# EAGLE design Flasche_v1 (EAGLE 6.4)
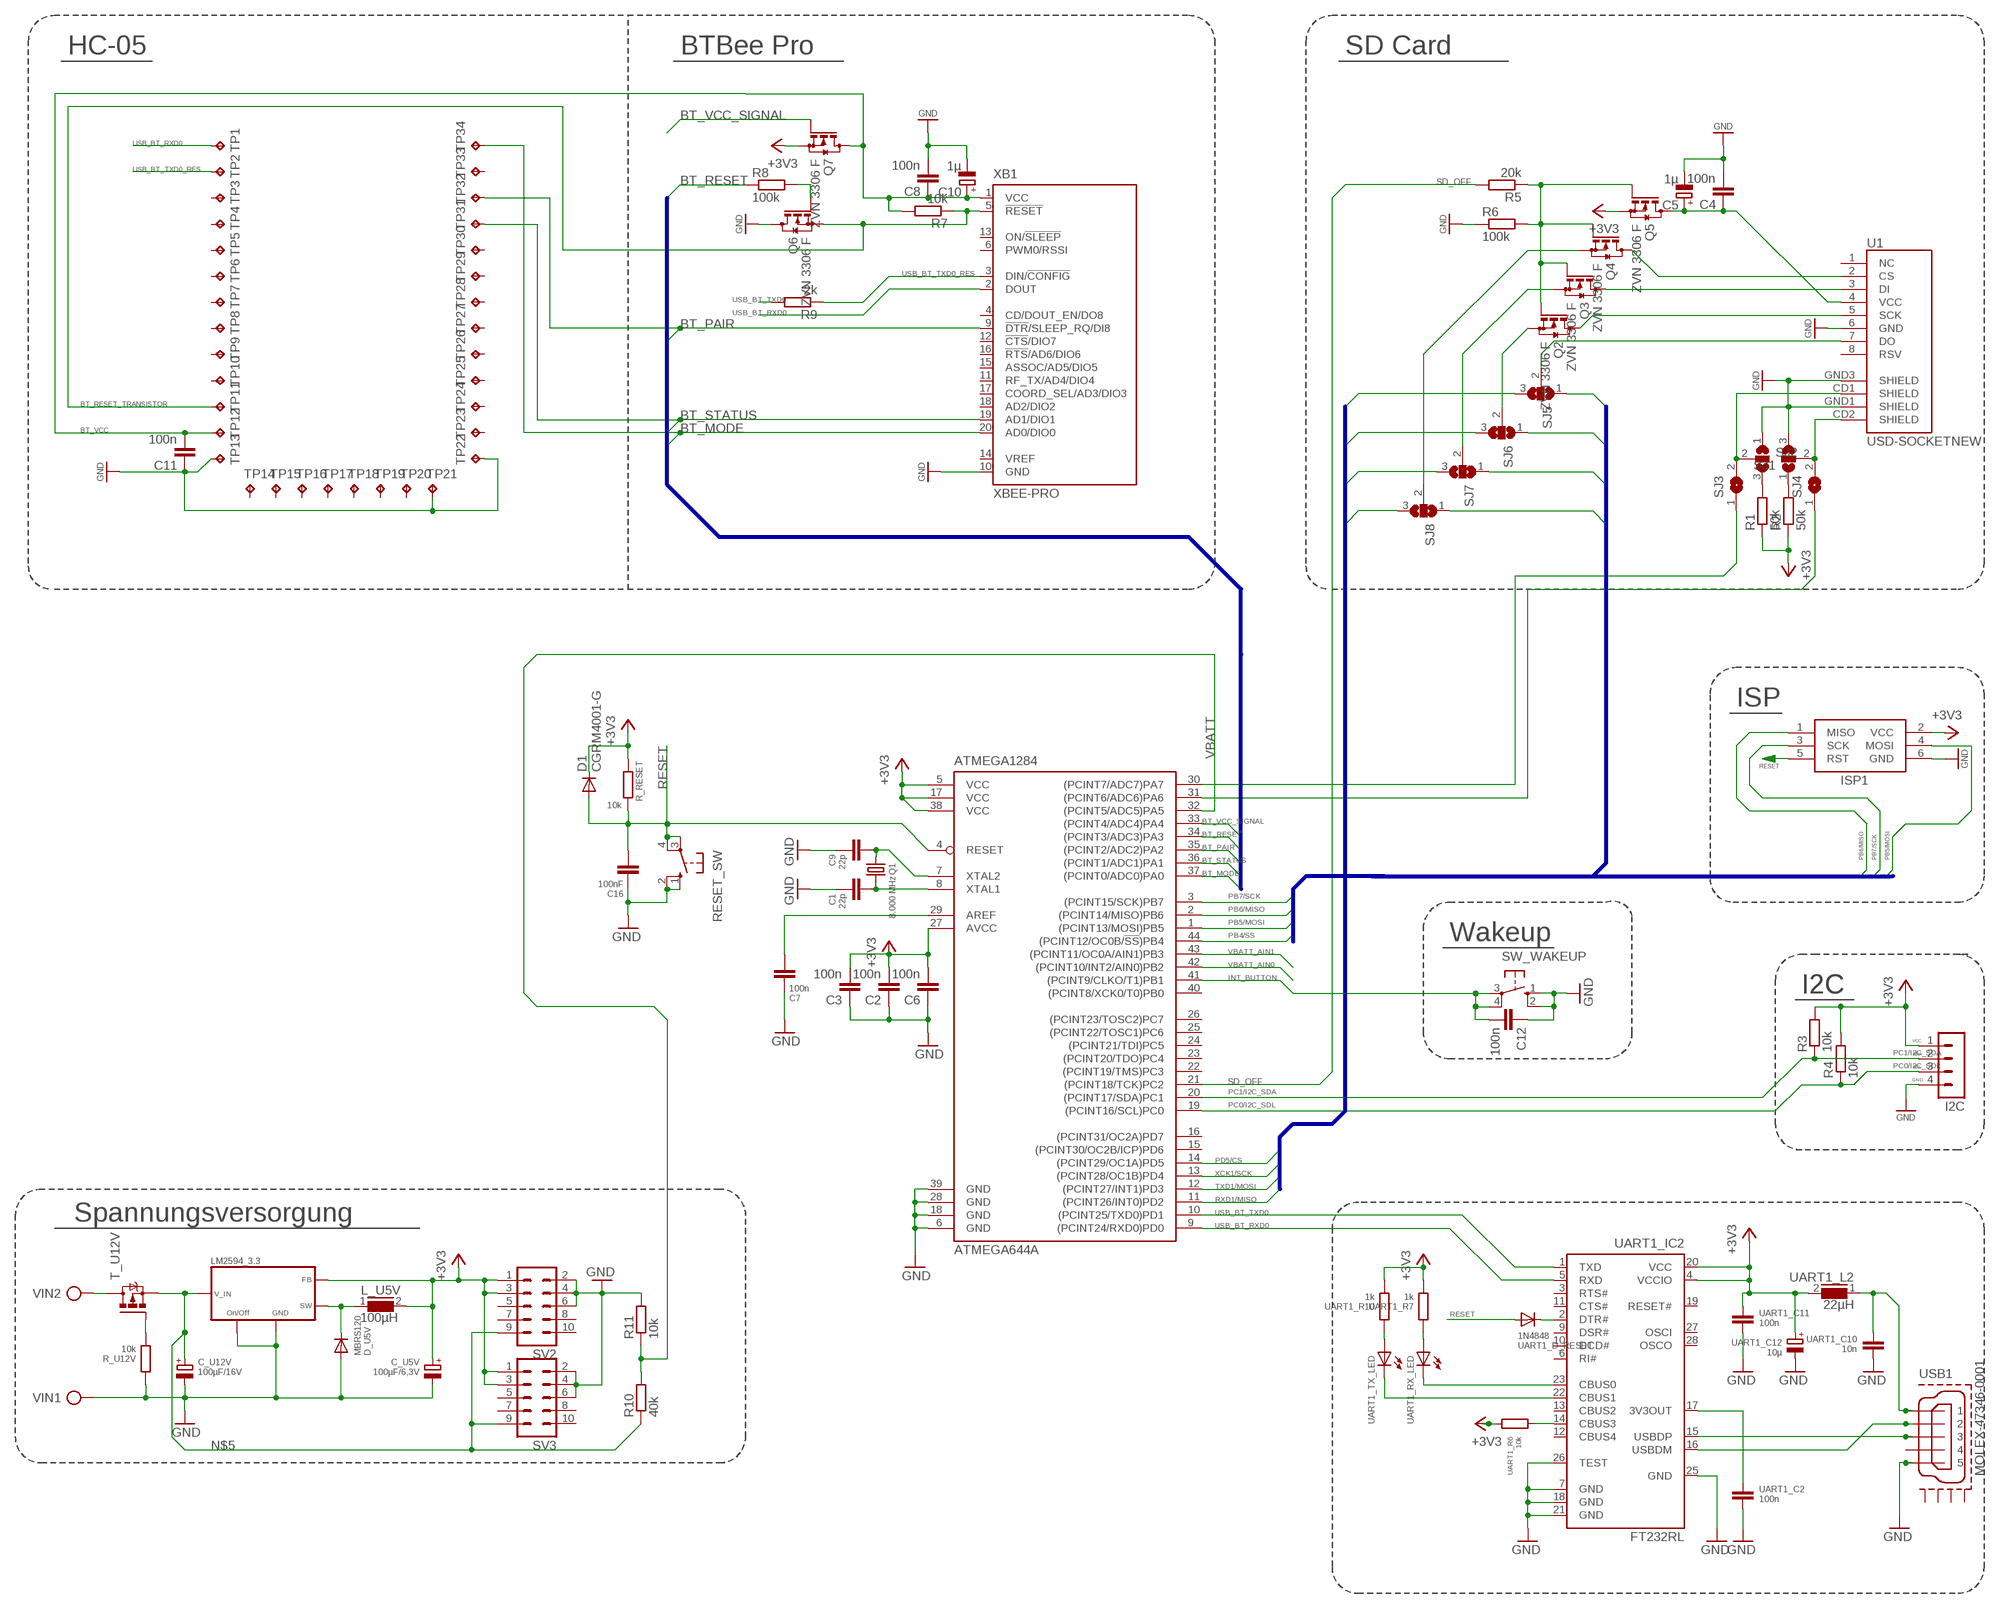
[diagram p0: schematic, sheet 1]

## Parts
ATMEGA1284  ATMEGA644A  [TQFP44]
C1  22p  C-0805  [C0805]
C2  100n  C-0805  [C0805]
C3  100n  C-0805  [C0805]
C4  100n  C-0805  [C0805]
C5  1µ  CPOL-EUSMCD  [SMC_D]
C6  100n  C-0805  [C0805]
C7  100n  C-0805  [C0805]
C8  100n  C-0805  [C0805]
C9  22p  C-0805  [C0805]
C10  1µ  CPOL-EUSMCD  [SMC_D]
C11  100n  C-0805  [C0805]
C12  100n  C-0805  [C0805]
C16  100nF  C-0805  [C0805]
C_U5V  100µF/6,3V  CPOL-EUSMCD  [SMC_D]
C_U12V  100µF/16V  CPOL-EUSMCD  [SMC_D]
D1  CGRM4001-G  [SOD-123_MINI-SMA]
D_U5V  MBRS120  D_SMB  [SMB]
I2C  MA04-1  [MA04-1]
ISP1  AVRISP-6  [AVRISP]
L_U5V  100µH  L_PISM  [PISM]
LM2594_3.3  LM2594  [SO08]
Q1  8.000 MHz  CRYSTALHC18U-V  [HC18U-V]
Q2  ZVN 3306 F  BSS123  [SOT23]
Q3  ZVN 3306 F  BSS123  [SOT23]
Q4  ZVN 3306 F  BSS123  [SOT23]
Q5  ZVN 3306 F  BSS123  [SOT23]
Q6  ZVN 3306 F  BSS123  [SOT23]
Q7  ZVN 3306 F  BSS123  [SOT23]
R1  50k  R-EU_M1206  [M1206]
R2  50k  R-EU_M1206  [M1206]
R3  10k  R-EU_M1206  [M1206]
R4  10k  R-EU_M1206  [M1206]
R5  20k  R-EU_M1206  [M1206]
R6  100k  R-EU_M1206  [M1206]
R7  10k  R-EU_M1206  [M1206]
R8  100k  R-EU_M1206  [M1206]
R9  2k  R-EU_M1206  [M1206]
R10  40k  R-EU_M1206  [M1206]
R11  10k  R-EU_M1206  [M1206]
R_RESET  10k  R-R0805  [R0805]
R_U12V  10k  R-R0805  [R0805]
RESET_SW  10-XX  [B3F-10XX]
SJ1  SJ2W  [SJ_2]
SJ2  SJ2W  [SJ_2]
SJ3  SJ  [SJ]
SJ4  SJ  [SJ]
SJ5  SJ2W  [SJ_2]
SJ6  SJ2W  [SJ_2]
SJ7  SJ2W  [SJ_2]
SJ8  SJ2W  [SJ_2]
SV2  ML10L  [ML10L]
SV3  ML10L  [ML10L]
SW_WAKEUP  10-XX  [B3F-10XX]
T_U12V  MOS_P_SOT23_GDS  [SOT23]
TP1  TPTP06SQ  [TP06SQ]
TP2  TPTP06SQ  [TP06SQ]
TP3  TPTP06SQ  [TP06SQ]
TP4  TPTP06SQ  [TP06SQ]
TP5  TPTP06SQ  [TP06SQ]
TP6  TPTP06SQ  [TP06SQ]
TP7  TPTP06SQ  [TP06SQ]
TP8  TPTP06SQ  [TP06SQ]
TP9  TPTP06SQ  [TP06SQ]
TP10  TPTP06SQ  [TP06SQ]
TP11  TPTP06SQ  [TP06SQ]
TP12  TPTP06SQ  [TP06SQ]
TP13  TPTP06SQ  [TP06SQ]
TP14  TPTP06SQ  [TP06SQ]
TP15  TPTP06SQ  [TP06SQ]
TP16  TPTP06SQ  [TP06SQ]
TP17  TPTP06SQ  [TP06SQ]
TP18  TPTP06SQ  [TP06SQ]
TP19  TPTP06SQ  [TP06SQ]
TP20  TPTP06SQ  [TP06SQ]
TP21  TPTP06SQ  [TP06SQ]
TP22  TPTP06SQ  [TP06SQ]
TP23  TPTP06SQ  [TP06SQ]
TP24  TPTP06SQ  [TP06SQ]
TP25  TPTP06SQ  [TP06SQ]
TP26  TPTP06SQ  [TP06SQ]
TP27  TPTP06SQ  [TP06SQ]
TP28  TPTP06SQ  [TP06SQ]
TP29  TPTP06SQ  [TP06SQ]
TP30  TPTP06SQ  [TP06SQ]
TP31  TPTP06SQ  [TP06SQ]
TP32  TPTP06SQ  [TP06SQ]
TP33  TPTP06SQ  [TP06SQ]
TP34  TPTP06SQ  [TP06SQ]
U1  USD-SOCKETNEW  [MICRO-SD-SOCKET-PP]
UART1_C2  100n  C-EUC0805  [C0805]
UART1_C10  10n  C-EUC0805  [C0805]
UART1_C11  100n  C-EUC0805  [C0805]
UART1_C12  10µ  CPOL-EUSMCD  [SMC_D]
UART1_D_RESET  1N4848  D_MINIMELF  [MINIMELF]
UART1_IC2  FT232RL  [SSOP28]
UART1_L2  22µH  L_PIS2408  [PIS2408]
UART1_R6  10k  R-EU_R0805  [R0805]
UART1_R7  1k  R-R0805  [R0805]
UART1_R10  1k  R-R0805  [R0805]
UART1_RX_LED  LEDCHIPLED_0805  [CHIPLED_0805]
UART1_TX_LED  LEDCHIPLED_0805  [CHIPLED_0805]
USB1  MOLEX-47346-0001  [MOLEX-47364-0001]
VIN  AK350/2  [AK350/2]
XB1  XBEE-PRO  [XBEE-PRO]

## Nets
+3V3: ATMEGA1284.5(VCC) ATMEGA1284.17(VCC) ATMEGA1284.27(AVCC) ATMEGA1284.38(VCC) C2.2 C3.2 C6.2 C_U5V.+ D1.C I2C.1 ISP1.2(VCC) L_U5V.2 LM2594_3.3.4(FB) Q5.2(S) Q7.2(S) R1.1 R2.1 R3.2 R4.2 R_RESET.2 SV2.1 SV2.3 SV3.1 SV3.3 UART1_C11.1 UART1_C12.+ UART1_IC2.4(VCCIO) UART1_IC2.20(VCC) UART1_L2.2 UART1_R6.2 UART1_R7.1 UART1_R10.1
AREF: ATMEGA1284.29(AREF) C7.2
BT_MODE: ATMEGA1284.37((PCINT0/ADC0)PA0) TP34.TP XB1.20(AD0/DIO0)
BT_PAIR: ATMEGA1284.35((PCINT2/ADC2)PA2) TP32.TP XB1.9(!DTR!/SLEEP_RQ/DI8)
BT_RESET: ATMEGA1284.34((PCINT3/ADC3)PA3) R8.1
BT_RESET_TRANSISTOR: Q6.2(S) R7.1 TP11.TP XB1.5(!RESET)
BT_STATUS: ATMEGA1284.36((PCINT1/ADC1)PA1) TP31.TP XB1.19(AD1/DIO1)
BT_VCC: C8.1 C10.+ C11.2 Q7.3(D) R7.2 TP12.TP XB1.1(VCC)
BT_VCC_SIGNAL: ATMEGA1284.33((PCINT4/ADC4)PA4) Q7.1(G)
DTR#: UART1_D_RESET.C UART1_IC2.2(DTR#)
GND: ATMEGA1284.6(GND) ATMEGA1284.18(GND) ATMEGA1284.28(GND) ATMEGA1284.39(GND) C1.1 C2.1 C3.1 C4.2 C5.- C6.1 C7.1 C8.2 C9.1 C10.- C11.1 C12.1 C16.1 C_U5V.- C_U12V.- D_U5V.A I2C.4 ISP1.6(GND) LM2594_3.3.5(ON/OFF) LM2594_3.3.6(GND) Q6.3(D) R6.1 R11.2 R_U12V.2 RESET_SW.1(S) RESET_SW.2(S1) SJ1.3 SJ2.1 SV2.2 SV2.4 SV2.6 SV3.2 SV3.4 SV3.6 SW_WAKEUP.1(S) SW_WAKEUP.2(S1) TP13.TP TP21.TP TP22.TP U1.6(GND) U1.GND1(SHIELD) U1.GND3(SHIELD) UART1_C2.2 UART1_C10.2 UART1_C11.2 UART1_C12.- UART1_IC2.7(GND) UART1_IC2.18(GND) UART1_IC2.21(GND) UART1_IC2.25(GND) UART1_IC2.26(TEST) USB1.5 VIN.P$1 XB1.10(GND)
INT_BUTTON: ATMEGA1284.41((PCINT9/CLKO/T1)PB1) C12.2 SW_WAKEUP.3(P) SW_WAKEUP.4(P1)
N$1: UART1_R10.2 UART1_TX_LED.A
N$2: UART1_C2.1 UART1_IC2.17(3V3OUT)
N$3: T_U12V.2(D) VIN.P$2
N$4: UART1_IC2.16(USBDM) USB1.2
N$5: C_U12V.+ LM2594_3.3.7(IN) R10.1 SV2.9 SV3.9 T_U12V.3(S)
N$9: UART1_R7.2 UART1_RX_LED.A
N$10: UART1_IC2.15(USBDP) USB1.3
N$11: UART1_IC2.14(CBUS3) UART1_R6.1
N$12: UART1_C10.1 UART1_L2.1 USB1.1
N$13: UART1_IC2.23(CBUS0) UART1_RX_LED.C
N$14: UART1_IC2.22(CBUS1) UART1_TX_LED.C
N$16: SJ2.2 SJ3.2 U1.CD1(SHIELD)
N$17: SJ1.2 SJ4.2 U1.CD2(SHIELD)
N$18: R_U12V.1 T_U12V.1(G)
N$20: ATMEGA1284.31((PCINT6/ADC6)PA6) SJ4.1
N$21: R1.2 SJ2.3
N$22: R2.2 SJ1.1
N$24: SJ5.2 U1.7(DO)
N$25: ATMEGA1284.30((PCINT7/ADC7)PA7) SJ3.1
N$26: Q2.2(S) SJ6.2
N$27: Q3.2(S) SJ7.2
N$28: Q4.3(D) U1.2(CS)
N$29: Q3.3(D) U1.3(DI)
N$30: Q2.3(D) U1.5(SCK)
N$31: C4.1 C5.+ Q5.3(D) U1.4(VCC)
N$33: Q2.1(G) Q3.1(G) Q4.1(G) Q5.1(G) R5.1 R6.2
N$34: Q6.1(G) R8.2
PB4/SS: ATMEGA1284.44((PCINT12/OC0B/!SS!)PB4) SJ8.1
PB5/MOSI: ATMEGA1284.1((PCINT13/MOSI)PB5) ISP1.4(MOSI) SJ7.1
PB6/MISO: ATMEGA1284.2((PCINT14/MISO)PB6) ISP1.1(MISO) SJ5.1
PB7/SCK: ATMEGA1284.3((PCINT15/SCK)PB7) ISP1.3(SCK) SJ6.1
PC0/I2C_SDL: ATMEGA1284.19((PCINT16/SCL)PC0) I2C.3 R4.1
PC1/I2C_SDA: ATMEGA1284.20((PCINT17/SDA)PC1) I2C.2 R3.1
PD5/CS: ATMEGA1284.14((PCINT29/OC1A)PD5) SJ8.3
RESET: ATMEGA1284.4(RESET) C16.2 D1.A ISP1.5(RST) R_RESET.1 RESET_SW.3(P) RESET_SW.4(P1) UART1_D_RESET.A
RXD1/MISO: ATMEGA1284.11((PCINT26/INT0)PD2) SJ5.3
SD_CS: Q4.2(S) SJ8.2
SD_OFF: ATMEGA1284.21((PCINT18/TCK)PC2) R5.2
SWITCH_OUT: D_U5V.C L_U5V.1 LM2594_3.3.8(SW)
TXD1/MOSI: ATMEGA1284.12((PCINT27/INT1)PD3) SJ7.3
USB_BT_RXD0: ATMEGA1284.9((PCINT24/RXD0)PD0) TP1.TP UART1_IC2.5(RXD) XB1.2(DOUT)
USB_BT_TXD0: ATMEGA1284.10((PCINT25/TXD0)PD1) R9.2 UART1_IC2.1(TXD)
USB_BT_TXD0_RES: R9.1 TP2.TP XB1.3(DIN/!CONFIG)
VBATT: ATMEGA1284.32((PCINT5/ADC5)PA5) R10.2 R11.1
VBATT_AIN0: ATMEGA1284.42((PCINT10/INT2/AIN0)PB2)
VBATT_AIN1: ATMEGA1284.43((PCINT11/OC0A/AIN1)PB3)
XCK1/SCK: ATMEGA1284.13((PCINT28/OC1B)PD4) SJ6.3
XTAL1: ATMEGA1284.8(XTAL1) C1.2 Q1.1
XTAL2: ATMEGA1284.7(XTAL2) C9.2 Q1.2
Unconnected: ATMEGA1284.15((PCINT30/OC2B/ICP)PD6) ATMEGA1284.16((PCINT31/OC2A)PD7) ATMEGA1284.22((PCINT19/TMS)PC3) ATMEGA1284.23((PCINT20/TDO)PC4) ATMEGA1284.24((PCINT21/TDI)PC5) ATMEGA1284.25((PCINT22/TOSC1)PC6) ATMEGA1284.26((PCINT23/TOSC2)PC7) ATMEGA1284.40((PCINT8/XCK0/T0)PB0) SV2.5 SV2.7 SV2.8 SV2.10 SV3.5 SV3.7 SV3.8 SV3.10 TP3.TP TP4.TP TP5.TP TP6.TP TP7.TP TP8.TP TP9.TP TP10.TP TP14.TP TP15.TP TP16.TP TP17.TP TP18.TP TP19.TP TP20.TP TP23.TP TP24.TP TP25.TP TP26.TP TP27.TP TP28.TP TP29.TP TP30.TP TP33.TP U1.1(NC) U1.8(RSV) UART1_IC2.3(RTS#) UART1_IC2.6(RI#) UART1_IC2.9(DSR#) UART1_IC2.10(DCD#) UART1_IC2.11(CTS#) UART1_IC2.12(CBUS4) UART1_IC2.13(CBUS2) UART1_IC2.19(RESET#) UART1_IC2.27(OSCI) UART1_IC2.28(OSCO) USB1.4 USB1.GND1 USB1.GND2 USB1.GND3 USB1.GND4 XB1.4(CD/DOUT_EN/DO8) XB1.6(PWM0/RSSI) XB1.11(RF_TX/AD4/DIO4) XB1.12(!CTS!/DIO7) XB1.13(ON/!SLEEP) XB1.14(VREF) XB1.15(ASSOC/AD5/DIO5) XB1.16(!RTS!/AD6/DIO6) XB1.17(COORD_SEL/AD3/DIO3) XB1.18(AD2/DIO2)

## Buses
BLUETOOTH:BT_VCC_SIGNAL,BT_RESET,BT_PAIR,BT_STATUS,BT_MODE
SPI_NATIV:PB7/SCK,PB6/MISO,PB5/MOSI,PB4/SS
SPI_ALTERNATIV:PD5/CS,XCK1/SCK,TXD1/MOSI,RXD1/MISO

## Notes on the sheet
- HC-05 | BTBee Pro | SD Card
- (TCK) | (TMS) | (TDO) | (TDI) | (RESET) | (SCK) | (PDI/MOSI) | (PDO/MISO)
- (TCK) | (TMS) | (TDO) | (TDI) | (RESET) | (SCK) | (PDI/MOSI) | (PDO/MISO)
- ISP
- Wakeup
- I2C | I2C
- VCC
- SDA
- SCL
- GND
- Spannungsversorgung

## Library data of the parts
ATMEGA1284 = atmel:ATMEGA644: 8-bit Microcontroller with 64K Bytes In-System Programmable Flash Source: http://www.atmel.com/dyn/resources/prod_documents/doc2593.pdf; MPN: ATMEGA644PV-10AU; OC_FARNELL: 1455123; OC_NEWARK: 58M3748
C1-C4 C6-C9 C11 C12 C16 = quantum-sensor:C: Capacitor
C5 C10 = rcl:CPOL-EU: POLARIZED CAPACITOR, European symbol
C_U5V C_U12V UART1_C12 = _E:CPOL-EU: POLARIZED CAPACITOR, European symbol
D1 = diode:CGRM400*-G: Molded plasitc,JEDEC SOD-123/Mini SMA Source: Comchip CGRM4001-G.pdf
D_U5V UART1_D_RESET = _D:D: DIODE Name Package Type Reverse Voltage Forward Current Reverse Recovery Time trr SB320, SB330, SB340, SB350, SB360, SB380, SB3100 Do201 Schottky 20V, 30V, 40V, 50V, 60V, 80V, 100V 3A SB520, SB530, SB540, SB550, SB560 Do201 Schottky 20V, 30V, 40V, 50V, 60V 5A 1N5817, 1N5818, 1N5819 Do201 Schottky 20V, 30V, 40V 1A 1N5820, 1N5821, 1N5822 Do201 Schottky 20V, 30V, 40V 3A 1N4001, 1N4002, 1N4003, 1N4004, 1N4005, 1N4006, 1N4007 Do41 Standard 50V, 100V, 200V, 400V, 600V, 800V, 1000V 1A (4001,...,4004) 50ns, (4005, ..,4007) 75ns 1N4148 Do35 / MiniMELF Standard 100V 150mA 4ns BYV26A, BYV26B, BYV26C, BYV26D, BYV26E SOD57 Ultra Fast 200V, 400V ,600V, 800V, 1000V 2A (BYV26A,...,BYV26C) 30ns, (BYV26D, BYV26E) 75ns BYV27-600 SOD57 Ultra Fast 600V 2A 35ns MBRS120 SMB Schottky 20V 1A MBRS340 SMC Schottky 40V 3A BAT85 DO-34 Schottky 30V 200mA
I2C = con-lstb:MA04-1: PIN HEADER; OC_FARNELL: unknown; OC_NEWARK: unknown
ISP1 = adafruit:AVRISP: AVR ISP HEADER Standard 6 pin header for AVR programming
L_U5V UART1_L2 = _Trafo_Spule:L: INDUCTOR
LM2594_3.3 = _Voltage_Regulators:LM2594: LM2594/LM2594HV SIMPLE SWITCHER® Power Converter 150 kHz 0.5A Step-Down Voltage Regulator
Q1 = crystal:CRYSTAL: CRYSTAL; OC_FARNELL: unknown; OC_NEWARK: unknown
Q2-Q7 = transistor-small-signal:BSS123: N-CHANNEL MOS FET
R1-R11 = rcl:R-EU_: RESISTOR, European symbol
R_RESET R_U12V UART1_R7 UART1_R10 = quantum-sensor:R: Resistor
RESET_SW SW_WAKEUP = switch-omron:10-XX: OMRON SWITCH; MPN: B3F-1000; OC_FARNELL: 176432; OC_NEWARK: 36M3542
SJ1 SJ2 SJ5-SJ8 = jumper:SJ2W: SMD solder JUMPER
SJ3 SJ4 = jumper:SJ: SMD solder JUMPER
SV2 SV3 = con-ml:ML10L: HARTING; OC_FARNELL: unknown; OC_NEWARK: unknown
T_U12V = _transistor:MOS_P: P - CHANNEL ENHANCEMENT MODE (POWER ) MOS TRANSISTOR Name Package VDS ID PD RDS(on) VGS ttd(on) tr ttd(off) tf IRF9530 TO220_GDS -100V 12A 75W 0.3Ω ±20V 30ns 70ns 70ns 70ns FDN360P SOT23_GDS -30V -2.0A 0.5W 0.1Ω ±20V 6ns 13ns 11ns 6ns
TP1-TP34 = testpad:TP: Test pad
U1 = SparkFun-Connectors:USD-SOCKET: microSD Socket Push-push type uSD socket. Schematic element and footprint production proven. Spark Fun Electronics SKU : PRT-00127. tDoc lines correctly indicate media card edge positions when inserting (unlocked, locked, depressed).
UART1_C2 UART1_C10 UART1_C11 = _C:C-EU: CAPACITOR, European symbol
UART1_IC2 = FTDI:FT232R: Source: http://www.ftdichip.com/Documents/DataSheets/DS_FT232R_v104.pdf
UART1_R6 = _R:R-EU_: RESISTOR, European symbol
UART1_RX_LED UART1_TX_LED = led:LED: LED OSRAM: - CHIPLED LG R971, LG N971, LY N971, LG Q971, LY Q971, LO R971, LY R971 LH N974, LH R974 LS Q976, LO Q976, LY Q976 LO Q996 - Hyper CHIPLED LW Q18S LB Q993, LB Q99A, LB R99A - SideLED LS A670, LO A670, LY A670, LG A670, LP A670 LB A673, LV A673, LT A673, LW A673 LH A674 LY A675 LS A676, LA A676, LO A676, LY A676, LW A676 LS A679, LY A679, LG A679 - Hyper Micro SIDELED® LS Y876, LA Y876, LO Y876, LY Y876 LT Y87S - SmartLED LW L88C, LW L88S LB L89C, LB L89S, LG L890 LS L89K, LO L89K, LY L89K LS L896, LA L896, LO L896, LY L896 - TOPLED LS T670, LO T670, LY T670, LG T670, LP T670 LSG T670, LSP T670, LSY T670, LOP T670, LYG T670 LG T671, LOG T671, LSG T671 LB T673, LV T673, LT T673, LW T673 LH T674 LS T676, LA T676, LO T676, LY T676, LB T676, LH T676, LSB T676, LW T676 LB T67C, LV T67C, LT T67C, LS T67K, LO T67K, LY T67K, LW E67C LS E67B, LA E67B, LO E67B, LY E67B, LB E67C, LV E67C, LT E67C LW T67C LS T679, LY T679, LG T679 LS T770, LO T770, LY T770, LG T770, LP T770 LB T773, LV T773, LT T773, LW T773 LH T774 LS E675, LA E675, LY E675, LS T675 LS T776, LA T776, LO T776, LY T776, LB T776 LHGB T686 LT T68C, LB T68C - Hyper Mini TOPLED® LB M676 - Mini TOPLED Santana® LG M470 LS M47K, LO M47K, LY M47K Source: http://www.osram.convergy.de LUXEON: - LUMILED® LXK2-PW12-R00, LXK2-PW12-S00, LXK2-PW14-U00, LXK2-PW14-V00 LXK2-PM12-R00, LXK2-PM12-S00, LXK2-PM14-U00 LXK2-PE12-Q00, LXK2-PE12-R00, LXK2-PE12-S00, LXK2-PE14-T00, LXK2-PE14-U00 LXK2-PB12-K00, LXK2-PB12-L00, LXK2-PB12-M00, LXK2-PB14-N00, LXK2-PB14-P00, LXK2-PB14-Q00 LXK2-PR12-L00, LXK2-PR12-M00, LXK2-PR14-Q00, LXK2-PR14-R00 LXK2-PD12-Q00, LXK2-PD12-R00, LXK2-PD12-S00 LXK2-PH12-R00, LXK2-PH12-S00 LXK2-PL12-P00, LXK2-PL12-Q00, LXK2-PL12-R00 Source: www.luxeon.com KINGBRIGHT: KA-3528ASYC Source: www.kingbright.com
USB1 = usb_con-update:MOLEX-47346-0001: MICRO USB B, BOTTOM MOUNT
VIN = con-ptr500:AK350/2: CONNECTOR Raster: 3,5mm
XB1 = maxstream:XBEE: XBee (TM) /XBee-PRO(TM) OEM RF Modules Source: MaxStream, Inc. xbee_productmanual.pdf; MPN: XBP24-AWI-001; OC_FARNELL: 1337916; OC_NEWARK: 42M2667

## Board
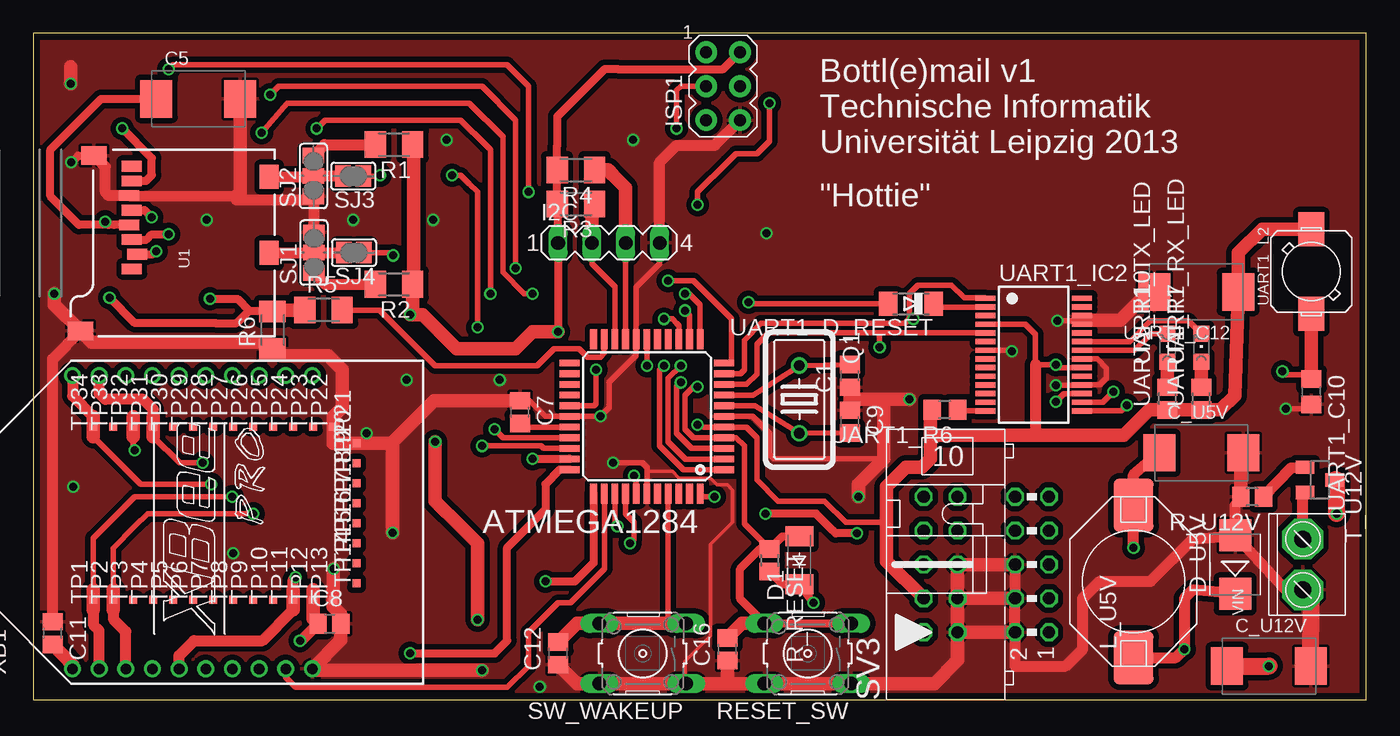
[diagram p1: board, top side]
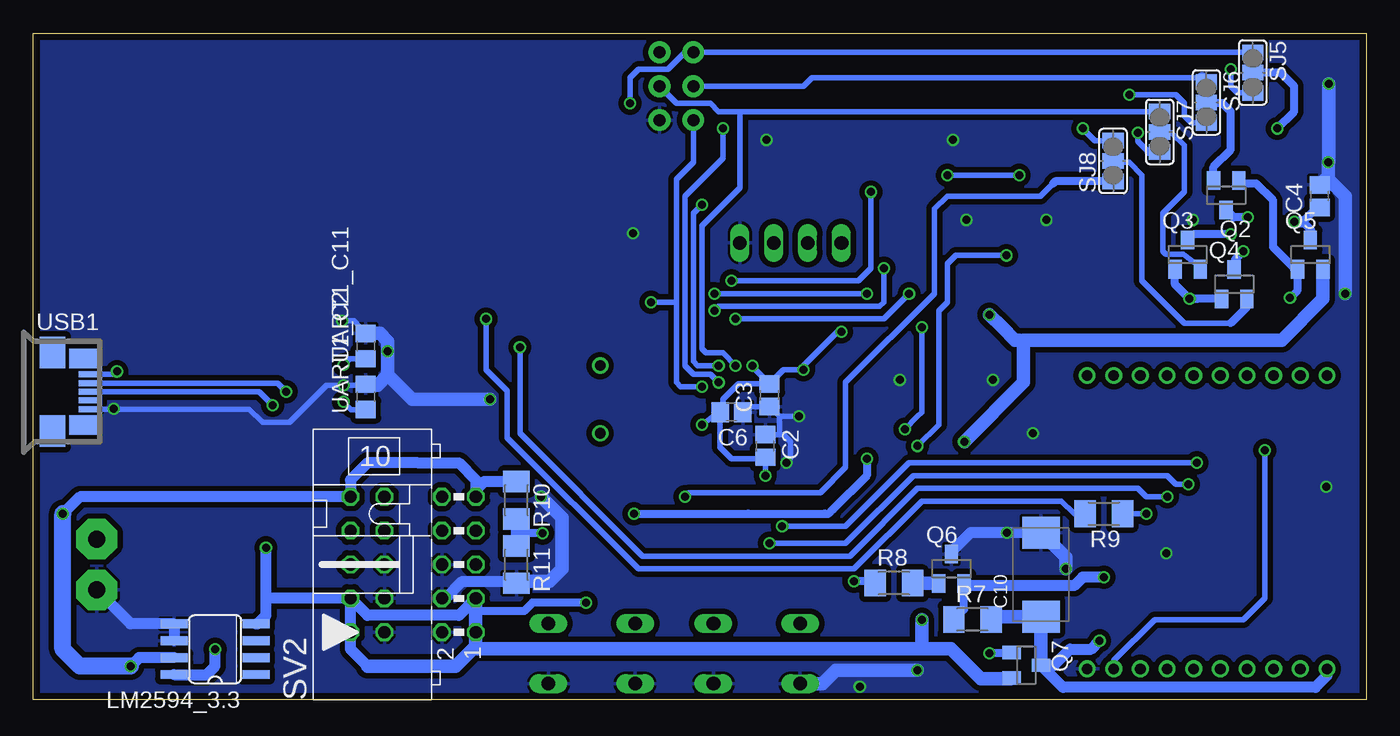
[diagram p2: board, bottom side, seen from below]

Size 100 x 50 mm. Coordinates in mm from the lower left corner, seen from the top.
Outline: 0,0 100,0 100,50 0,50 0,0
Copper layers (1*16): Top 0.035mm / dielectric 1.5mm / Bottom 0.035mm
Design rules "Eagle-DRU - 1203 - LeitOn - 01 and 02 layers": minimum track width 6mil, minimum drill 0.3mm, track to track 6mil, track to pad 6mil, pad to pad 6mil, via to via 6mil, smd to smd 6mil, copper to edge 20mil, drill to drill 10mil, minimum pad ring 8mil, minimum via ring 6mil, stop-mask expansion 3mil, vias tented up to drill 0mil, thermal gap 8mil

### Footprints (pad centres in the part's own frame; a part is rotated, then mirrored left to right if it is on the bottom)
TQFP44 = smd 1.5 x 0.5: 1 -5.8,4; 2 -5.8,3.2; 3 -5.8,2.4; 4 -5.8,1.6; 5 -5.8,0.8; 6 -5.8,0; 7 -5.8,-0.8; 8 -5.8,-1.6; 9 -5.8,-2.4; 10 -5.8,-3.2; 11 -5.8,-4; 23 5.8,-4; 24 5.8,-3.2; 25 5.8,-2.4; 26 5.8,-1.6; 27 5.8,-0.8; 28 5.8,0; 29 5.8,0.8; 30 5.8,1.6; 31 5.8,2.4; 32 5.8,3.2; 33 5.8,4 | smd 0.5 x 1.5: 12 -4,-5.8; 13 -3.2,-5.8; 14 -2.4,-5.8; 15 -1.6,-5.8; 16 -0.8,-5.8; 17 0,-5.8; 18 0.8,-5.8; 19 1.6,-5.8; 20 2.4,-5.8; 21 3.2,-5.8; 22 4,-5.8; 34 4,5.8; 35 3.2,5.8; 36 2.4,5.8; 37 1.6,5.8; 38 0.8,5.8; 39 0,5.8; 40 -0.8,5.8; 41 -1.6,5.8; 42 -2.4,5.8; 43 -3.2,5.8; 44 -4,5.8
C0805 = smd 1.3 x 1.5: 1 -0.85,0; 2 0.85,0
SMC_D = smd 2.4 x 2.8: + -3.15,0; - 3.15,0
SOD-123_MINI-SMA = smd 1.5 x 2.1: A 1.8,0; C -1.8,0
SMB = smd 2.4 x 2.4: A 2.2,0; C -2.2,0
MA04-1 = drill 1.016 long: 1 -3.81,0; 2 -1.27,0; 3 1.27,0; 4 3.81,0
AVRISP = drill 0.9 pad 1.626: 1 -1.27,2.54; 2 1.27,2.54; 3 -1.27,0; 4 1.27,0; 5 -1.27,-2.54; 6 1.27,-2.54
PISM = smd 4 x 3: 1 -5.715,0; 2 5.715,0
SO08 = smd 0.66 x 2.032: 1 -1.905,-3.073; 2 -0.635,-3.073; 3 0.635,-3.073; 4 1.905,-3.073; 5 1.905,3.073; 6 0.635,3.073; 7 -0.635,3.073; 8 -1.905,3.073
HC18U-V = drill 0.813: 1 -2.54,0; 2 2.54,0
SOT23 = smd 1 x 1.4: 1 -0.95,-1.1; 2 0.95,-1.1; 3 0,1.1
M1206 = smd 1.6 x 2: 1 -1.4,0; 2 1.4,0
R0805 = smd 1.3 x 1.5: 1 -0.85,0; 2 0.85,0
B3F-10XX = drill 1.016 long: 1 -3.251,2.261; 2 3.251,2.261; 3 -3.251,-2.261; 4 3.251,-2.261
SJ_2 = smd 1.168 x 1.6: 1 -1.524,0; 2 0,0; 3 1.524,0
SJ = smd 1.168 x 1.6: 1 -0.762,0; 2 0.762,0
ML10L = drill 0.914 octagon: 1 -5.08,-1.27; 2 -5.08,1.27; 3 -2.54,-1.27; 4 -2.54,1.27; 5 0,-1.27; 6 0,1.27; 7 2.54,-1.27; 8 2.54,1.27; 9 5.08,-1.27; 10 5.08,1.27
TP06SQ = smd 0.6 x 0.6: TP 0,0
MICRO-SD-SOCKET-PP = smd 0.8 x 1.5: 1 -8.94,10.7; 2 -7.84,10.3; 3 -6.74,10.7; 4 -5.64,10.9; 5 -4.54,10.7; 6 -3.44,10.9; 7 -2.34,10.7; 8 -1.24,10.7 | smd 1.8 x 1.4: CD1 -2.05,0.4; CD2 -7.75,0.4 | smd 1.4 x 1.9: GND1 -13.6,14.55; GND3 -0.45,13.55
C0805' = smd 1.3 x 1.5: 1 -0.95,0; 2 0.95,0
MINIMELF = smd 1.4 x 1.8: A 1.7,0; C -1.7,0
SSOP28 = smd 0.4 x 1.5: 1 -4.225,-3.625; 2 -3.575,-3.625; 3 -2.925,-3.625; 4 -2.275,-3.625; 5 -1.625,-3.625; 6 -0.975,-3.625; 7 -0.325,-3.625; 8 0.325,-3.625; 9 0.975,-3.625; 10 1.625,-3.625; 11 2.275,-3.625; 12 2.925,-3.625; 13 3.575,-3.625; 14 4.225,-3.625; 15 4.225,3.625; 16 3.575,3.625; 17 2.925,3.625; 18 2.275,3.625; 19 1.625,3.625; 20 0.975,3.625; 21 0.325,3.625; 22 -0.325,3.625; 23 -0.975,3.625; 24 -1.625,3.625; 25 -2.275,3.625; 26 -2.925,3.625; 27 -3.575,3.625; 28 -4.225,3.625
PIS2408 = smd 2.54 x 1.93: 1 -3.175,0; 2 3.175,0
R0805' = smd 1.3 x 1.5: 1 -0.95,0; 2 0.95,0
CHIPLED_0805 = smd 1.2 x 1.2: A 0,-1.05; C 0,1.05
MOLEX-47364-0001 = smd 1.7 x 0.45: 1 2.8,1.3; 2 2.8,0.65; 3 2.8,0; 4 2.8,-0.65; 5 2.8,-1.3 | smd 1.9 x 2.375: GND1 0,2.95; GND4 0,-2.95 | smd 2.1 x 1.475: GND2 2.3,2.5; GND3 2.3,-2.5
AK350/2 = drill 1.27 pad 3.048 octagon: P$1 -1.905,0; P$2 1.905,0
XBEE-PRO = drill 0.8 pad 1.27: 1 -11,9; 2 -11,7; 3 -11,5; 4 -11,3; 5 -11,1; 6 -11,-1; 7 -11,-3; 8 -11,-5; 9 -11,-7; 10 -11,-9; 11 11,-9; 12 11,-7; 13 11,-5; 14 11,-3; 15 11,-1; 16 11,1; 17 11,3; 18 11,5; 19 11,7; 20 11,9

### Placement (x,y rotation side)
ATMEGA1284  46.04,21.27 180 top
C1  61.26,24.31 90 top
C2  45.09,19.05 270 bottom
C3  44.77,22.86 90 bottom
C4  3.49,37.78 90 bottom
C5  12.38,45.09 0 top
C6  47.62,21.59 180 bottom
C7  36.51,21.59 270 top
C8  22.23,5.71 0 top
C9  61.26,20.88 270 top
C10  24.4,9.4 90 bottom
C11  1.45,5.01 270 top
C12  39.37,3.49 90 top
C16  52.07,3.81 90 top
C_U5V  87.63,18.54 0 top
C_U12V  92.71,2.54 0 top
D1  57.47,10.48 90 top
D_U5V  90.17,10.16 90 top
I2C  43.18,34.29 0 top
ISP1  51.75,46.04 0 top
L_U5V  82.55,8.89 90 top
LM2594_3.3  86.36,3.81 90 bottom
Q1  57.47,22.54 270 top
Q2  10.5,37.86 180 bottom
Q3  13.4,33.4 0 bottom
Q4  9.91,31.18 0 bottom
Q5  4.19,33.4 0 bottom
Q6  31.11,9.84 0 bottom
Q7  25.5,2.6 270 bottom
R1  27.05,41.66 180 top
R2  27.05,31.18 180 top
R3  40.7,37.21 180 top
R4  40.7,39.75 180 top
R5  21.77,29.25 0 top
R6  17.95,27.75 90 top
R7  29.53,6.03 0 bottom
R8  35.43,8.76 0 bottom
R9  19.68,13.97 180 bottom
R10  63.75,14.99 270 bottom
R11  63.75,10.16 270 bottom
R_RESET  55.24,10.48 270 top
R_U12V  91.44,15.24 180 top
RESET_SW  58.1,3.49 180 top
SJ1  21.06,33.55 90 top
SJ2  21.02,39.31 90 top
SJ3  24,39.29 180 top
SJ4  24.05,33.55 180 top
SJ5  8.51,47.05 270 bottom
SJ6  11.99,44.82 270 bottom
SJ7  15.49,42.61 270 bottom
SJ8  18.99,40.42 90 bottom
SV2  68.07,10.16 90 bottom
SV3  74.93,10.16 90 top
SW_WAKEUP  45.72,3.49 180 top
T_U12V  96.52,16.51 270 top
TP1  4.5,7.5 90 top
TP2  6,7.5 90 top
TP3  7.5,7.5 90 top
TP4  9,7.5 90 top
TP5  10.5,7.5 90 top
TP6  12,7.5 90 top
TP7  13.5,7.5 90 top
TP8  15,7.5 90 top
TP9  16.5,7.5 90 top
TP10  18,7.5 90 top
TP11  19.5,7.5 90 top
TP12  21,7.5 90 top
TP13  22.5,7.5 90 top
TP14  24.25,8.75 90 top
TP15  24.25,10.25 90 top
TP16  24.25,11.75 90 top
TP17  24.25,13.25 90 top
TP18  24.25,14.75 90 top
TP19  24.25,16.25 90 top
TP20  24.25,17.75 90 top
TP21  24.25,19.25 90 top
TP22  22.5,20.5 90 top
TP23  21,20.5 90 top
TP24  19.5,20.5 90 top
TP25  18,20.5 90 top
TP26  16.5,20.5 90 top
TP27  15,20.5 90 top
TP28  13.5,20.5 90 top
TP29  12,20.5 90 top
TP30  10.5,20.5 90 top
TP31  9,20.5 90 top
TP32  7.5,20.5 90 top
TP33  6,20.5 90 top
TP34  4.5,20.5 90 top
U1  18.1,41.27 90 top
UART1_C2  100n  [C0805']  75.06,22.73 90 bottom
UART1_C10  10n  [C0805']  95.89,23.11 270 top
UART1_C11  100n  [C0805']  75.06,26.54 90 bottom
UART1_C12  87.25,30.61 180 top
UART1_D_RESET  65.85,29.72 180 top
UART1_IC2  75.06,25.91 270 top
UART1_L2  95.89,32.13 90 top
UART1_R6  10k  [R0805']  68.39,21.78 180 top
UART1_R7  87.63,22.61 90 top
UART1_R10  85.09,22.61 90 top
UART1_RX_LED  87.63,26.42 0 top
UART1_TX_LED  85.09,26.42 0 top
USB1  98.55,23.11 0 bottom
VIN  95.25,10.16 90 top
XB1  11.94,13.34 90 top

### Tracks (layer width: path | path; a pad name or v marks a point on that pad's centre or on a via)
+3V3  (via drill 0.6, 0.6 pad 0.2)
  Top 0.406: UART1_IC2.20 76.92,24.93 v76.71,25.15 75.18,25.15 75.18,27.43 74.43,28.18 UART1_IC2.4 | 63.69,15.88 64.01,15.56 | v49.85,20.64 50.32,20.47 ATMEGA1284.5 53.51,20.47 54.29,19.68 54.29,16.51 55.88,14.92 59.37,14.92 60.96,13.34 61.28,13.34 64.01,13.34 | ATMEGA1284.38 45.24,16.68 v45.09,16.83 | ATMEGA1284.27 42.08,22.07 42.23,22.23 v42.23,24.77 | ATMEGA1284.17 v46.04,25.08
  Top 0.61: R_RESET.2 56.2,8.68 D1.C v58.52,7.3 | 39.37,37.15 I2C.1 v39.37,27.62 | R3.2 R4.2 39.3,41.59 39.3,43.75 42.86,47.31 43.81,47.31 51.75,47.31 ISP1.2 | R1.1 28.52,41.59 | 28.45,29.09 v28.26,28.89
  Top 0.813: C_U5V.+ 82.55,16.89 L_U5V.2 v82.55,11.43 | 75.18,25.15 75.18,19.84
  Top 1.016: UART1_L2.2 92.2,35.31 90.42,33.53 UART1_C12.+ 90.14,22.84 89.07,21.76 UART1_R7.1 UART1_R10.1 83.73,21.76 81.82,19.84 75.18,19.84 67.31,19.84 | SV2.3 64.01,10.41 64.01,13.34 64.01,15.56 64.01,16 65.47,17.46 66.67,17.46 67.31,18.1 67.31,19.84 | 39.37,37.15 R3.2 | UART1_R6.2 67.31,21.78 67.31,19.84 | 28.52,41.59 28.52,31.24 R2.1 28.45,29.09 | v33.34,6.03 33.34,11.75 32.07,13.02 30.16,14.92 v30.16,19.37 | v28.26,28.89 29.21,28.89 31.75,26.35 36.2,26.35 37.15,27.3 37.47,27.62 v39.37,27.62
  Bottom 0.406: v76.71,25.15 76.26,25.59 UART1_C11.1 | v49.85,20.64 48.58,21.59 C6.2 | v45.09,16.83 C2.2 45.19,18.1 47.62,18.1 48.48,18.95 C6.2 | v39.37,27.62 39.69,27.62 42.23,25.08 v42.23,24.77 43.71,24.77 C3.2 | C3.2 47.09,23.71 48.26,22.54 48.26,21.8 C6.2 | v46.04,25.08 46.04,24.98 C3.2
  Bottom 0.61: v58.52,7.3 62.55,7.3 63.18,6.67 66.8,6.67 | 25.72,26.99 26.04,26.99 | 27.3,27.94 v28.26,28.89
  Bottom 0.813: LM2594_3.3.4 83.19,5.71 82.55,6.35 82.55,7.62 | 82.55,7.62 v82.55,11.43 | SV3.3 SV3.1 76.2,3.81 74.93,2.54 | SV3.3 82.55,7.62 | SV2.3 68.07,6.35 74.93,6.35 SV3.3
  Bottom 1.016: 74.93,2.54 68.33,2.54 67.02,3.84 | 67.02,3.84 66.8,4.06 SV2.1 66.8,6.67 SV2.3 | Q7.2 26.66,1.59 28.89,1.59 31.15,3.84 33.34,3.84 | 33.34,3.84 67.02,3.84 | Q5.2 3.24,30.1 6.35,26.99 25.72,26.99 25.72,23.81 v30.16,19.37 | 26.04,26.99 26.35,26.99 27.3,27.94 v28.26,28.89 | 33.34,3.84 v33.34,6.03
AREF
  Top 0.406: ATMEGA1284.29 36.78,20.47 C7.2
BT_MODE  (via drill 0.6)
  Top 0.406: 4.5,19.75 8.06,16.19 v13.34,16.19 | ATMEGA1284.37 44.44,13.98 45.09,13.34 45.09,12.06 v44.77,11.75
  Top 0.813: XB1.20 2.94,22.81 4.5,21.25
  Top 1: 4.5,19.75 TP34.TP 4.5,21.25
  Bottom 0.406: v44.77,11.75 39.05,11.75 33.97,16.83 14.92,16.83 14.29,16.19 v13.34,16.19
BT_PAIR  (via drill 0.6)
  Top 0.406: 7.5,19.75 7.5,18.85 v7.62,18.73 | XB1.9 18.94,1.7 19.68,0.95 35.56,0.95 37.15,2.54 37.15,5.08 39.37,7.3 40.32,7.3 42.86,9.84 42.86,15.45 ATMEGA1284.35
  Top 1: 7.5,19.75 TP32.TP 7.5,21.25
  Bottom 0.406: XB1.9 18.94,2.97 15.88,6.03 9.21,6.03 7.94,7.3 7.62,7.62 v7.62,18.73
BT_RESET  (via drill 0.6)
  Top 0.61: v38.42,8.89 40.64,8.89 41.27,9.53 42.04,10.29 ATMEGA1284.34
  Bottom 0.61: R8.1 36.83,8.89 v38.42,8.89
BT_RESET_TRANSISTOR  (via drill 0.6)
  Top 0.813: XB1.5 10.94,3.32 12.06,4.45 17.2,4.45 19.5,6.75 | 19.5,8.25 19.5,9.02 v19.68,9.21
  Top 1: 19.5,8.25 TP11.TP 19.5,6.75
  Bottom 0.61: R7.1 30.16,6.79 Q6.2
  Bottom 0.813: v19.68,9.21 21.27,9.21 21.91,8.57 30,8.57 Q6.2
BT_STATUS  (via drill 0.6)
  Top 0.406: 9,19.75 10.97,17.78 v12.7,17.78 | v43.81,13.02 43.64,12.88 ATMEGA1284.36
  Top 0.813: 9,21.25 9,21.8 8.26,22.54 5.4,22.54 5.08,22.86 4.94,23 XB1.19
  Top 1: 9,19.75 TP31.TP 9,21.25
  Bottom 0.406: v43.81,13.02 39.05,13.02 34.29,17.78 v12.7,17.78
BT_VCC  (via drill 0.6)
  Top 0.813: v20,4.45 20.11,4.45 C8.1
  Top 1: 21,8.25 TP12.TP 21,6.09 C8.1
  Top 1.016: XB1.1 2.94,2.6 C11.2
  Bottom 0.813: XB1.1 2.94,1.82 3.81,0.95 22.74,0.95 Q7.3 23.43,2.6 22.23,3.81 20.64,3.81 v20,4.45
  Bottom 1.016: Q7.3 C10.+ 27.91,6.25 R7.2
BT_VCC_SIGNAL  (via drill 0.6)
  Top 0.61: v28.26,3.49 30.16,3.49 31.43,3.49 34.61,3.49 35.56,4.45 35.56,11.43 38.42,14.29 38.42,16.19 39.5,17.27 ATMEGA1284.33
  Bottom 0.61: Q7.1 26.66,3.49 v28.26,3.49
DTR#
  Top 0.406: UART1_IC2.2 71.4,29.45 67.82,29.45 UART1_D_RESET.C
GND  (via drill 0.6)
  Top 0.254: 46.04,17.14 47.94,17.14 48.45,16.64 50.8,16.64 51.31,16.13 52.07,16.13 52.45,15.75 52.45,13.34 50.8,11.68 50.8,4.83 48.9,2.92 48.9,1.27 49.02,1.14 49.02,1.27
  Top 0.406: UART1_IC2.26 78.68,28.48 UART1_IC2.25 78.49,28.45 v76.83,28.45 | v76.71,23.62 UART1_IC2.18 80.02,23.63 80.52,24.13 80.52,24.89 79.83,25.58 UART1_IC2.21 | v93.98,21.84 95.56,21.84 UART1_C10.2 | C_U5V.- 90.78,18.64 | UART1_IC2.7 73.33,26.23 v73.41,26.16 | ATMEGA1284.39 46.04,17.14 46.04,17.46 45.72,17.78 v43.5,17.78 | I2C.4 46.99,32.7 45.24,30.95 ATMEGA1284.18 45.24,25.87 43.18,23.81 43.18,21.91 v42.55,21.27 ATMEGA1284.28 38.42,21.27 37.25,22.44 C7.1 | ATMEGA1284.6 53.98,21.27 55.24,20 55.24,18.41 55.56,18.1 63.82,18.1 | 26.97,19.23 26.89,19.23 26.87,19.25
  Top 0.61: v2.86,40.32 3.36,40.83 U1.GND3
  Top 0.813: VIN.P$1 93.98,8.26 D_U5V.A | D_U5V.A 90.17,14.61 R_U12V.2 | SV3.2 73.66,2.54 77.47,2.54 78.74,3.81 78.74,7.62 80.01,8.89 83.82,8.89 87,12.06 D_U5V.A | SV3.6 SV3.4 SV3.2 | SV3.2 73.66,3.81 | U1.GND3 5.4,39.98 5.4,38.1 5.66,37.84 U1.6 15.24,37.78 15.24,37.52 20.65,37.52 SJ2.1 21.02,35.12 SJ1.3 | C11.1 1.44,25.57 U1.GND1 | ISP1.6 51.12,41.59 48.26,41.59 46.99,40.32 I2C.4
  Top 1: 25,19.25 TP21.TP 22.5,19.25 TP22.TP 22.5,21.25 | 22.5,8.25 TP13.TP 22.5,7 23.07,6.42 C8.2
  Top 1.016: R_U12V.2 90.59,18.86 C_U5V.- | SV2.2 SV3.2 | SV2.2 SV2.4 | SV2.4 SV2.6 73.41,10.16 | SV2.4 SV3.4 | 78.68,28.48 81.57,28.48 83.84,30.76 UART1_C12.- | C8.2 23.07,4.47 XB1.10 20.94,2.22 v33.66,2.22 | 22.5,8.25 22.5,9.8 v22.54,9.84 | v1.59,30.48 1.59,29.64 U1.GND1 4.39,26.84 17.56,26.84 18.59,25.81 | C5.- 15.53,38.08 15.24,37.78 | SV2.2 69.34,2.98 67.59,1.23 RESET_SW.1 RESET_SW.2 52.07,1.23 | 52.07,1.23 SW_WAKEUP.1 SW_WAKEUP.2 40.78,1.23 C12.1 | C16.1 52.07,1.23 | C9.1 61.27,22.54 | 61.27,22.54 C1.1 | v65.72,22.54 63.82,22.54 | 63.82,22.54 61.27,22.54 | v61.91,15.24 61.91,16.19 63.82,18.1 63.82,22.54 | 25,19.25 26.87,19.25 30.06,22.44 C7.1 | v26.97,12.55 26.97,19.23 | R6.1 18.59,25.81 | 22.5,21.25 23.18,21.93 23.18,24.76 23.18,24.77 22.14,25.81 18.59,25.81 | v2.79,46.23 2.79,47.5
  Top 1.27: C_U12V.- 95.89,7.62 VIN.P$1
  Bottom 0.406: UART1_C11.2 75.95,28.45 v76.83,28.45 | UART1_C2.2 75.12,23.62 v76.71,23.62 77.98,23.62 80.77,20.83 82.8,20.83 83.79,21.81 94.01,21.81 | USB1.5 94.01,21.81 | 94.01,21.81 v93.98,21.84 | 45.3,19.68 C2.1 44.13,19.9 | 44.03,21.27 C3.1 46.35,22.01 C6.1 | 44.03,21.27 v42.55,21.27 | v43.5,17.78 43.18,18.1 43.18,19.37 43.71,19.9 44.13,19.9 | 44.03,21.27 44.03,20 44.13,19.9
  Bottom 0.61: 2.96,39.16 2.86,39.27
  Bottom 0.813: LM2594_3.3.6 LM2594_3.3.5 92.71,5.71 VIN.P$1 | SV2.4 69.09,7.62 67.82,8.89 63.88,8.89 R11.2 | C10.- v26.97,12.55 29.68,12.55 31.11,11.11 Q6.3
  Bottom 1.016: 73.41,24.38 v73.41,26.16 73.41,26.92 73.97,27.49 UART1_C11.2 | 73.41,24.38 74.17,23.62 75,23.62 UART1_C2.2 | v22.54,9.84 22.54,10.7 C10.- | C4.2 2.96,39.16 1.59,37.78 v1.59,30.48 | 2.86,39.27 v2.86,40.32 2.79,40.39 v2.79,46.23 | 73.41,24.38 71.56,22.54 v65.72,22.54 | R11.2 63.62,8.89 61.28,8.89 60.33,9.84 60.33,13.65 v61.91,15.24 | v33.66,2.22 39.79,2.22 40.78,1.23 SW_WAKEUP.2
  other vias: 28,24 35,24 30,36 31,42 13,36 24,36 45,42 38,1 25,20 15,11 3,16 55,35
  pour Top (isolate 0.406, rank 6): 0,0 0,50 100,50 100,0
  pour Bottom (isolate 0.406, rank 6): 0,0 100,0 100,50 0,50
INT_BUTTON
  Top 0.406: ATMEGA1284.41 47.64,5.77 47.62,5.75
  Top 1.016: SW_WAKEUP.3 47.62,5.75 SW_WAKEUP.4 40.78,5.75 C12.2
N$1
  Top 1.016: UART1_R10.2 UART1_TX_LED.A
N$2  (via drill 0.6)
  Top 0.406: UART1_IC2.17 77.34,22.98 v76.71,22.35
  Bottom 0.406: v76.71,22.35 76.14,21.78 UART1_C2.1
N$3
  Top 0.813: VIN.P$2 95.25,15.24 T_U12V.2
N$4  (via drill 0.6)
  Top 0.406: v81.03,23.11 80.25,22.33 UART1_IC2.16
  Bottom 0.406: USB1.2 81.68,23.76 v81.03,23.11
N$5  (via drill 0.6 pad 0.2)
  Top 1.27: C_U12V.+ v92.71,2.54 | v97.79,13.97 97.79,16.51 T_U12V.3
  Bottom 0.813: LM2594_3.3.7 92.08,3.17 v92.71,2.54 | v97.79,13.97 96.52,15.24 SV3.9 76.2,16.51 74.93,17.78 71.12,17.78 68.07,17.78 66.8,16.51 66.8,15.75 | 66.8,15.75 SV2.9 | R10.1 66.16,16.39 66.8,15.75
  Bottom 1.27: v92.71,2.54 96.52,2.54 97.79,3.81 v97.79,13.97
N$9
  Top 1.016: UART1_R7.2 UART1_RX_LED.A
N$10  (via drill 0.6)
  Top 0.406: v82.04,22.1 81.63,21.68 UART1_IC2.15
  Bottom 0.406: USB1.3 83.06,23.11 v82.04,22.1
N$11
  Top 0.406: UART1_IC2.14 69.34,21.68 UART1_R6.1
N$12  (via drill 0.6)
  Top 0.406: v93.73,24.64 93.98,24.38 95.56,24.38 UART1_C10.1
  Top 1.016: 95.76,24 UART1_C10.1 95.75,24.2 USB1.1 95.89,24.55 UART1_L2.1
  Bottom 0.406: USB1.1 93.95,24.41 v93.73,24.64
N$13
  Top 0.406: UART1_IC2.23 82.25,26.88 83.82,28.45 86.65,28.45 UART1_RX_LED.C
N$14
  Top 0.406: UART1_IC2.22 82.62,26.23 83.57,27.18 83.85,27.47 UART1_TX_LED.C
N$16
  Top 0.813: U1.CD1 20.94,39.23 SJ2.2 23.23,39.31 SJ3.2
N$17
  Top 0.813: U1.CD2 21.03,33.52 SJ1.2 SJ4.2
N$18
  Top 0.813: T_U12V.1 94.36,17.4 R_U12V.1
N$20  (via drill 0.6)
  Top 0.406: ATMEGA1284.31 38.28,18.87 38.1,19.05 35.24,19.05 v33.66,19.05 | SJ4.1 26.77,33.55 v26.99,33.34
  Bottom 0.406: v33.66,19.05 32.07,20.64 32.07,24.13 32.07,29.21 31.43,29.84 31.43,32.7 30.8,33.34 v26.99,33.34
N$21
  Top 0.813: SJ2.3 21.84,41.66 R1.2
N$22
  Top 0.813: SJ1.1 21.91,31.18 R2.2
N$24  (via drill 0.6)
  Top 0.61: U1.7 8.46,38.94 8.89,39.37 8.89,40.64 v6.67,42.86
  Bottom 0.61: SJ5.2 6.73,47.05 6.41,47.05 5.4,46.04 5.4,44.13 v6.67,42.86
N$25  (via drill 0.6)
  Top 0.406: ATMEGA1284.30 35.26,19.67 35.24,19.68 v34.61,20.32 | 33.34,28.57 33.34,38.1 32.7,38.73 32.14,39.29 32.07,39.37 v31.43,39.37 | 33.34,28.57 v33.34,27.94 33.34,28.57 | SJ3.1 25.96,39.29 v26.04,39.37
  Bottom 0.406: v34.61,20.32 33.66,21.27 33.34,21.59 v33.34,27.94 | v26.04,39.37 v31.43,39.37
N$26
  Bottom 0.61: Q2.2 11.45,39.98 10.16,41.27 10.16,44.13 10.79,44.77 11.94,44.77
  Bottom 0.813: 11.94,44.77 SJ6.2
N$27
  Bottom 0.406: Q3.2 12.45,32.45 13.72,33.44 14.67,33.44 15.02,33.44 15.24,33.66 15.24,36.51 13.65,38.1 13.65,41.59 14.61,42.55 15.43,42.55
  Bottom 0.813: 15.43,42.55 SJ7.2
N$28  (via drill 0.6)
  Top 0.61: U1.2 8.99,33.44 v9.21,33.66
  Bottom 0.61: v9.21,33.66 9.84,33.02 9.84,32.34
  Bottom 0.813: 9.84,32.34 Q4.3
N$29  (via drill 0.6)
  Top 0.61: U1.3 8.5,34.53 8.89,34.92 v10.16,34.92
  Bottom 0.61: v10.16,34.92 12.97,34.92 Q3.3
N$30  (via drill 0.6)
  Top 0.61: U1.5 8.35,36.73 v8.89,36.2
  Bottom 0.61: v8.89,36.2 9.94,36.2 Q2.3
N$31  (via drill 0.6)
  Top 0.61: U1.4 6.05,35.63 | 6.05,35.63 5.64,35.63 v5.4,35.88 | 6.05,35.63 3.42,35.63 1.91,37.15 1.27,37.78 1.27,41.27 5.08,45.09 C5.+
  Bottom 0.61: 4.13,34.56 4.13,35.24 4.76,35.88 3.71,36.93
  Bottom 0.813: v5.4,35.88 4.76,35.88 | 4.13,34.56 Q5.3 | 3.71,36.93 C4.1
N$33  (via drill 0.6)
  Top 0.61: v5.71,30.16 7.62,28.26 13.65,28.26 15.24,28.26 16.19,29.21 | 16.19,29.21 17.89,29.21 R6.2 | v13.25,30.08 15.32,30.08 16.19,29.21
  Top 0.813: 20.38,28.92 R5.1
  Top 1.016: R5.1 18.04,29.25 R6.2
  Bottom 0.61: 5.31,32.3 6.99,33.97 6.99,37.47 8.26,38.73 9.33,38.73 | Q4.1 12.7,30.08 | 12.7,30.08 v13.25,30.08 | v13.25,30.08 14.29,31.11 14.35,31.18 Q3.1 | v13.25,30.08 12.7,30.08 | v5.71,30.16 5.14,30.74 Q5.1
  Bottom 0.813: Q5.1 5.31,32.3 | 9.33,38.73 Q2.1
N$34
  Bottom 1.016: Q6.1 32.09,8.76 R8.2
PB4/SS  (via drill 0.6)
  Top 0.406: ATMEGA1284.44 50.27,15.24 v51.12,15.24
  Bottom 0.406: v51.12,15.24 50.8,15.56 40.96,15.56 39.05,17.46 39.05,23.81 32.38,30.48 32.38,35.56 32.38,36.83 31.43,37.78 29.84,37.78 24.45,37.78 23.5,38.73
  Bottom 0.61: SJ8.1 23.33,38.9 23.5,38.73
PB5/MOSI  (via drill 0.6)
  Top 0.406: ATMEGA1284.1 48.77,17.27 46.99,19.05 46.99,24.77 v47.31,25.08
  Bottom 0.406: SJ7.1 46.99,44.13 | 46.99,44.13 48.58,44.13 49.21,44.77 51.75,44.77 ISP1.4 | v47.31,25.08 48.26,26.04 49.53,26.04 49.85,26.35 49.85,35.56 46.99,38.42 46.99,44.13
PB6/MISO  (via drill 0.6)
  Top 0.406: ATMEGA1284.2 48.92,18.07 47.62,19.37 47.62,24.13 v48.58,25.08 | v49.85,37.15 49.85,38.1 52.07,40.32 52.7,40.96 54.29,40.96 55.24,41.91 v55.24,44.77
  Bottom 0.406: SJ5.1 ISP1.1 51.12,48.58 52.39,47.31 54.61,47.31 55.24,46.67 v55.24,44.77 | v48.58,25.08 50.16,25.08 50.48,25.4 50.48,36.51 v49.85,37.15
PB7/SCK  (via drill 0.6)
  Top 0.406: ATMEGA1284.3 49.39,18.87 48.26,20 48.26,23.5 v48.58,23.81 | v48.26,42.86 48.26,45.72 48.58,46.04 ISP1.3
  Bottom 0.406: 12.32,46.67 41.59,46.67 42.23,46.04 ISP1.3 | v48.58,23.81 49.21,24.45 50.48,24.45 51.12,25.08 51.12,37.78 48.26,40.64 v48.26,42.86
  Bottom 0.813: SJ6.1 12.32,46.67
PC0/I2C_SDL
  Top 0.406: ATMEGA1284.19 44.44,34.28 I2C.3
  Top 1.016: I2C.3 44.45,38.42 43.5,39.37 43.12,39.75 R4.1
PC1/I2C_SDA
  Top 0.406: ATMEGA1284.20 43.64,30.98 41.91,32.7 I2C.2
  Top 1.016: I2C.2 41.91,37.02 R3.1
PD5/CS  (via drill 0.6)
  Top 0.406: ATMEGA1284.14 48.44,28.08 48.26,28.26 47.94,28.57 v47.31,28.57 | v21.27,42.86 21.59,43.18 21.91,43.5 32.07,43.5 33.97,41.59 34.29,41.27 34.29,40.96 | 34.29,40.96 34.29,40.32 | v34.29,30.48 34.29,40.96
  Bottom 0.406: v47.31,28.57 38.1,28.57 36.2,28.57 v34.29,30.48 | SJ8.3 20.36,41.95 20.95,42.55 v21.27,42.86
RESET  (via drill 0.6)
  Top 0.406: 57.47,12.38 D1.A 57.47,12.06 | v49.85,23.5 49.53,23.5 48.9,22.86 48.9,20.32 49.54,19.67 ATMEGA1284.4 52.72,19.67 53.34,19.05 53.34,13.23 R_RESET.1 | UART1_D_RESET.A 53.78,29.72 v53.66,29.84
  Top 0.61: RESET_SW.3 RESET_SW.4 53.02,7.58 53.02,9.84 54.51,11.33 R_RESET.1 56.2,12.28 D1.A
  Top 1.016: C16.2 53.16,5.75 RESET_SW.4
  Bottom 0.406: v49.85,23.5 51.44,23.5 51.75,23.81 51.75,29.84 | 51.75,29.84 51.75,39.05 50.48,40.32 ISP1.5 | v53.66,29.84 51.75,29.84
RXD1/MISO  (via drill 0.6)
  Top 0.406: v10.16,47.31 10.48,47.62 21.59,47.62 35.56,47.62 37.15,46.04 37.15,40.32 v37.15,38.1 | ATMEGA1284.11 52.26,25.27 52.39,25.4 52.39,28.57 49.53,31.43 v47.62,31.43
  Bottom 0.406: SJ5.3 9.65,45.53 10.16,46.04 v10.16,47.31 | v47.62,31.43 38.1,31.43 37.15,32.38 v37.15,38.1
SD_CS
  Bottom 0.406: 10.16,28.26 13.65,28.26 16.83,31.43 16.83,39.37 17.78,40.32 18.89,40.32
  Bottom 0.61: Q4.2 8.96,29.46 10.16,28.26
  Bottom 0.813: 18.89,40.32 SJ8.2
SD_OFF
  Top 0.406: ATMEGA1284.21 42.84,26.01 42.55,25.72 41.59,25.72 40.96,26.35 39.05,26.35 37.78,25.08 30.16,25.08 26,29.25 R5.2
SWITCH_OUT  (via drill 0.6 pad 0.2)
  Top 0.813: D_U5V.C 87,8.26 86.36,7.62 v86.36,3.81 85.72,3.17 L_U5V.1
  Bottom 0.813: LM2594_3.3.8 87,1.91 86.36,2.54 v86.36,3.81
TXD1/MOSI  (via drill 0.6)
  Top 0.406: v17.14,42.55 19.05,44.77 32.7,44.77 35.24,42.23 35.24,40.32 35.24,32.07 36.83,30.48 v37.47,30.48 | ATMEGA1284.12 50.04,29.66 49.21,30.48 v48.9,30.48
  Bottom 0.406: 16.32,41.08 17.14,41.91 v17.14,42.55 | v48.9,30.48 38.1,30.48 v37.47,30.48
  Bottom 0.61: SJ7.3 16.32,41.08
USB_BT_RXD0  (via drill 0.6)
  Top 0.406: 4.5,8.25 4.5,12.12 7.62,15.24 v14.92,15.24 | UART1_IC2.5 63.5,27.53 | 63.5,27.53 55.16,27.53 54.29,26.67 54.29,24.45 53.52,23.67 ATMEGA1284.9 | 63.5,27.53 v63.5,26.45
  Top 0.813: 4.5,6.75 4.5,5.66 4.94,5.22 XB1.2
  Top 1: 4.5,6.75 TP1.TP 4.5,8.25
  Bottom 0.406: v14.92,15.24 16.51,15.24 17.14,15.88 33.66,15.88 38.73,10.79 54.29,10.79 63.5,20 v63.5,26.45
USB_BT_TXD0  (via drill 0.6)
  Top 0.406: ATMEGA1284.10 53.05,24.47 53.34,24.77 53.34,26.99 54.61,28.26 65.41,28.26 65.72,28.57 | 65.72,28.57 65.72,30.48 66.36,31.11 68.9,31.11 69.85,30.16 71.4,30.16 UART1_IC2.1 | 65.72,28.57 arc60 v66.04,28.57
  Bottom 0.406: R9.2 21.91,13.97 22.86,14.92 33.34,14.92 38.42,9.84 54.61,9.84 64.45,19.68 64.45,23.18 66.04,24.77 v66.04,28.57
USB_BT_TXD0_RES  (via drill 0.6)
  Top 0.406: 6,8.25 6,11.4 7.62,13.02 8.57,13.97 13.34,13.97 v16.51,13.97
  Top 0.813: 6,6.75 6,6.07 6.03,6.03 6.94,5.13 XB1.3
  Top 1: 6,6.75 TP2.TP 6,8.25
  Bottom 0.406: v16.51,13.97 R9.1
VBATT  (via drill 0.6)
  Top 0.61: v61.79,12.5 60.21,12.5 60.01,12.7 58.74,13.97 55.24,13.97 v54.93,13.97 | v37.47,18.1 40.21,18.1 ATMEGA1284.32
  Bottom 0.61: v37.47,18.1 37.47,16.83 40.01,14.29 40.32,13.97 40.64,13.97 46.35,13.97 v54.93,13.97 | v61.79,12.5 63.55,12.5 63.75,12.7
  Bottom 0.813: R11.1 63.75,12.5 63.75,12.7 R10.2
XCK1/SCK  (via drill 0.6)
  Top 0.406: v17.78,45.4 18.41,46.04 33.66,46.04 36.2,43.5 36.2,40.32 36.2,37.15 | ATMEGA1284.13 49.24,28.87 v48.9,29.21 | 36.2,37.15 36.2,36.83 | v36.2,32.38 36.2,37.15
  Bottom 0.406: SJ6.3 13.13,43.29 13.65,43.81 13.65,44.77 14.29,45.4 v17.78,45.4 | v48.9,29.21 48.58,29.53 38.1,29.53 36.51,29.53 36.2,29.84 v36.2,32.38
XTAL1
  Top 0.406: C1.2 Q1.1 53.99,22.87 ATMEGA1284.8
XTAL2
  Top 0.406: C9.2 Q1.2 54.13,22.07 ATMEGA1284.7

### Text on the board
tNames: Bottl(e)mail v1 / Technische Informatik / Universität Leipzig 2013 | "Hottie"